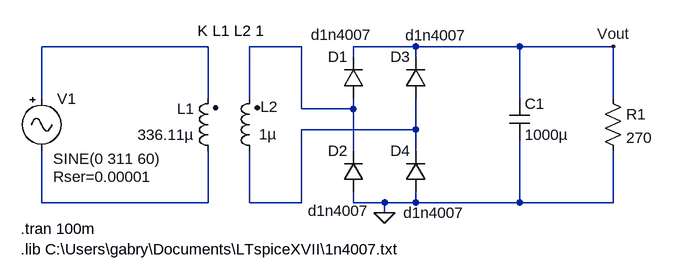
[diagram p0: schematic Draft2.asc]
Draft2.asc, the LTspice schematic file:
Version 4
SHEET 1 1528 680
WIRE 400 16 144 16
WIRE 544 16 464 16
WIRE 720 16 624 16
WIRE 880 16 720 16
WIRE 1024 16 880 16
WIRE 624 32 624 16
WIRE 720 32 720 16
WIRE 144 96 144 16
WIRE 400 96 400 16
WIRE 464 96 464 16
WIRE 880 96 880 16
WIRE 1024 96 1024 16
WIRE 544 112 544 16
WIRE 624 112 624 96
WIRE 624 112 544 112
WIRE 720 144 720 96
WIRE 720 144 544 144
WIRE 624 176 624 112
WIRE 720 176 720 144
WIRE 144 256 144 176
WIRE 400 256 400 176
WIRE 400 256 144 256
WIRE 464 256 464 176
WIRE 544 256 544 144
WIRE 544 256 464 256
WIRE 624 256 624 240
WIRE 672 256 624 256
WIRE 720 256 720 240
WIRE 720 256 672 256
WIRE 880 256 880 160
WIRE 880 256 720 256
WIRE 1024 256 1024 176
WIRE 1024 256 880 256
WIRE 672 272 672 256
FLAG 1024 16 Vout
FLAG 672 272 0
SYMBOL Misc\\signal 144 80 R0
WINDOW 123 0 0 Left 0
WINDOW 39 18 136 Left 2
WINDOW 3 18 109 Left 2
SYMATTR SpiceLine Rser=0.00001
SYMATTR InstName V1
SYMATTR Value SINE(0 311 60)
SYMBOL ind2 416 192 R180
WINDOW 0 36 80 Left 2
WINDOW 3 36 40 Left 2
SYMATTR InstName L1
SYMATTR Value 336.11µ
SYMATTR Type ind
SYMBOL ind2 480 192 R180
WINDOW 0 -28 83 Left 2
WINDOW 3 -26 41 Left 2
SYMATTR InstName L2
SYMATTR Value 1µ
SYMATTR Type ind
SYMBOL diode 640 96 R180
WINDOW 0 24 64 Left 2
WINDOW 3 -13 98 Left 2
SYMATTR InstName D1
SYMATTR Value d1n4007
SYMBOL diode 640 240 R180
WINDOW 0 24 64 Left 2
WINDOW 3 -9 -29 Left 2
SYMATTR InstName D2
SYMATTR Value d1n4007
SYMBOL diode 736 96 R180
WINDOW 0 24 64 Left 2
WINDOW 3 -63 97 Left 2
SYMATTR InstName D3
SYMATTR Value d1n4007
SYMBOL diode 736 240 R180
WINDOW 0 24 64 Left 2
WINDOW 3 -60 -32 Left 2
SYMATTR InstName D4
SYMATTR Value d1n4007
SYMBOL res 1008 80 R0
SYMATTR InstName R1
SYMATTR Value 270
SYMBOL cap 864 96 R0
SYMATTR InstName C1
SYMATTR Value 1000µ
TEXT 384 -8 Left 2 !K L1 L2 1
TEXT 112 296 Left 2 !.tran 100m
TEXT 112 328 Left 2 !.lib C:\\Users\\gabry\\Documents\\LTspiceXVII\\1n4007.txt

The netlist it stands for:
* Draft2.asc
V1 N001 N004 SINE(0 311 60) Rser=0.00001
L1 N004 N001 336.11µ
L2 N003 N002 1µ
D1 N002 Vout d1n4007
D2 0 N002 d1n4007
D3 N003 Vout d1n4007
D4 0 N003 d1n4007
R1 Vout 0 270
C1 Vout 0 1000µ
.model D D
.lib standard.dio
K L1 L2 1
.tran 100m
.lib C:\Users\gabry\Documents\LTspiceXVII\1n4007.txt
.backanno
.end